# Altium schematic sheet Sheet_assembly.SchDoc: Assembly
size 292 x 193 mm; ApprovedBy: Wojciech Szczytko; CheckedBy: Antoni Popecki; Author: Jakub Szczepaniak; CompanyName: Politechnika Warszawska; Organization: EITI; Address1: Nowowiejska 15/19; Address2: 00-665 Warszawa; DocumentNumber: 9; Revision: 1; SheetNumber: 1; SheetTotal: 9; HTTPLink: www.pw.edu.pl; Group_Name: Patelnia; ProjName: Nalesnik
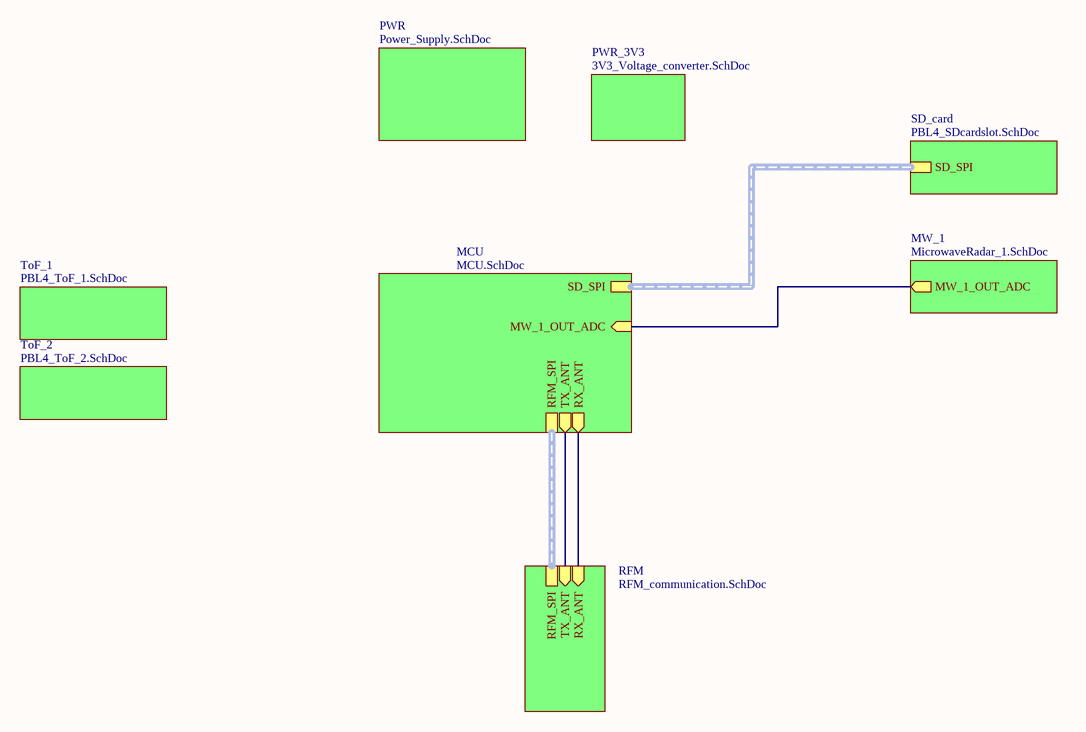
[diagram p0: Sheet_assembly.SchDoc]

## Sub-sheets
MCU = MCU.SchDoc: SD_SPI (harness SD_SPI), RFM_SPI (harness RFM_SPI), TX_ANT (out), RX_ANT (out), MW_1_OUT_ADC (in)
MW_1 = MicrowaveRadar_1.SchDoc: MW_1_OUT_ADC (out)
PWR = Power_Supply.SchDoc: no entries
PWR_3V3 = 3V3_Voltage_converter.SchDoc: no entries
RFM = RFM_communication.SchDoc: RX_ANT (in), TX_ANT (in), RFM_SPI (harness RFM_SPI)
SD_card = PBL4_SDcardslot.SchDoc: SD_SPI (harness SD_SPI)
ToF_1 = PBL4_ToF_1.SchDoc: no entries
ToF_2 = PBL4_ToF_2.SchDoc: no entries

## Nets
(unnamed): sheet MCU/TX_ANT, sheet RFM/TX_ANT
(unnamed): sheet MCU/RX_ANT, sheet RFM/RX_ANT
(unnamed): sheet MCU/MW_1_OUT_ADC, sheet MW_1/MW_1_OUT_ADC

## Buses and harness runs
harness sheet MCU/RFM_SPI = sheet RFM/RFM_SPI
harness sheet MCU/SD_SPI = sheet SD_card/SD_SPI

## Notes on the sheet
- Data:
- Tytuł:
- Rev.:
- Rozm.:
- A4
- Strona:
- z
- PBL4
- Opracował: